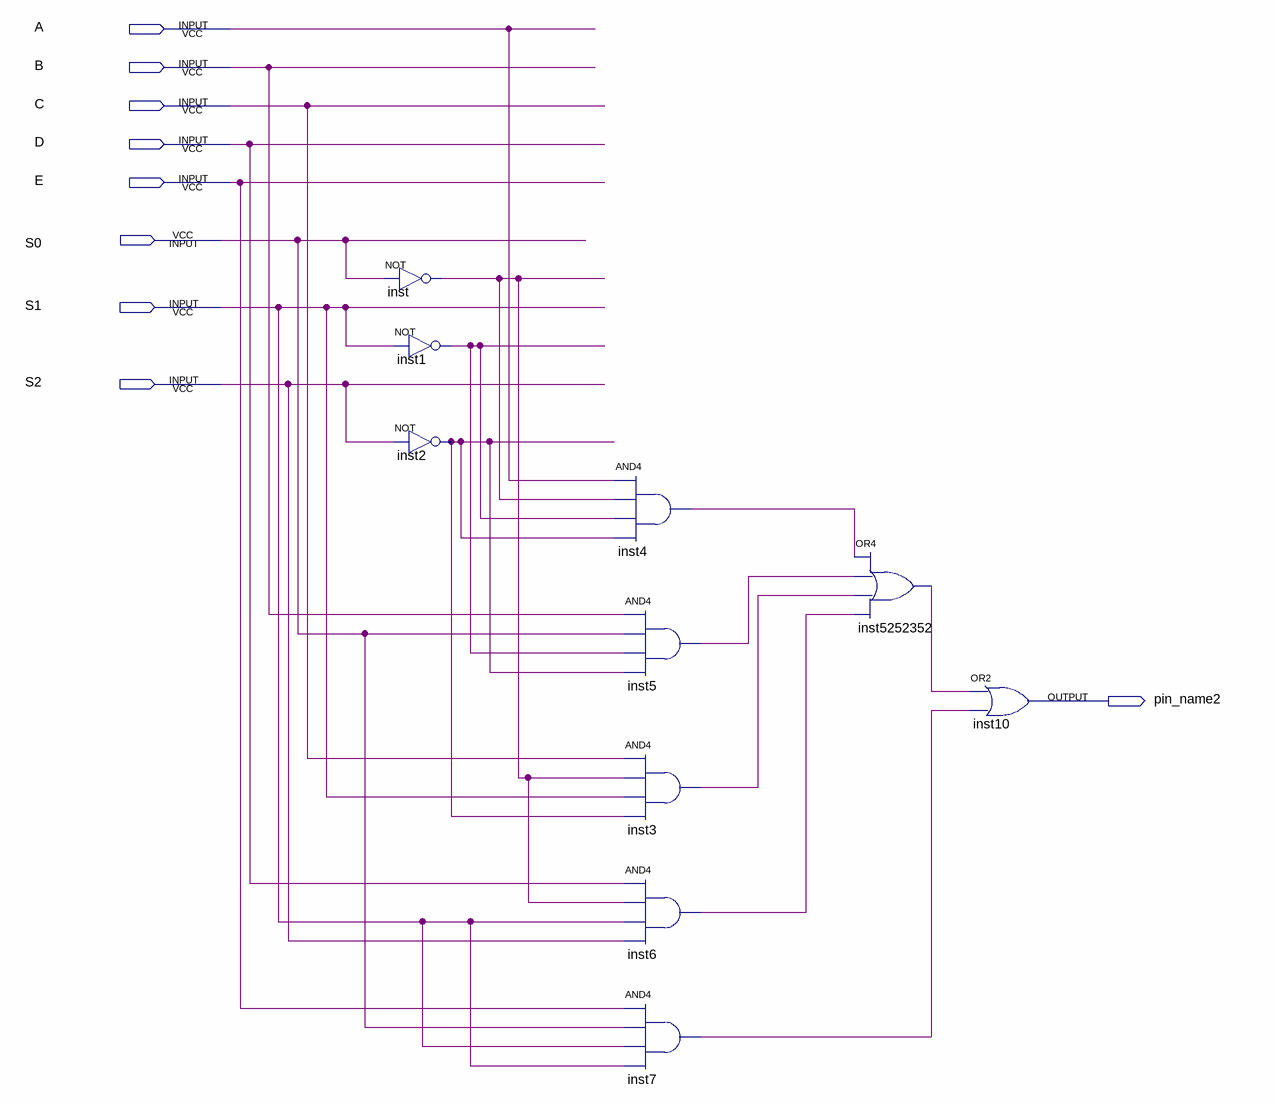
[diagram p0: schematic sheet]
// Quartus schematic mux_menor.bdf as structural Verilog: 10 symbols, 9 pins
module mux_menor (
  input  A,
  input  B,
  input  C,
  input  D,
  input  E,
  input  S0,
  input  S1,
  input  S2,
  output pin_name2
);

  wire inst1_out, inst2_out, inst3_out, inst4_out, inst5_out, inst6_out, inst7_out, inst5252352_out, inst_out;

  not inst (inst_out, S0);
  not inst1 (inst1_out, S1);
  not inst2 (inst2_out, S2);
  and inst4 (inst4_out, A, inst_out, inst1_out, inst2_out);
  and inst5 (inst5_out, B, S0, inst1_out, inst2_out);
  and inst3 (inst3_out, C, inst_out, S1, inst2_out);
  and inst6 (inst6_out, D, inst_out, S1, S2);
  and inst7 (inst7_out, E, S0, S1, S1);
  or inst5252352 (inst5252352_out, inst4_out, inst5_out, inst3_out, inst6_out);
  or inst10 (pin_name2, inst5252352_out, inst7_out);
endmodule
